# EAGLE design circuito (EAGLE 7.6.0)
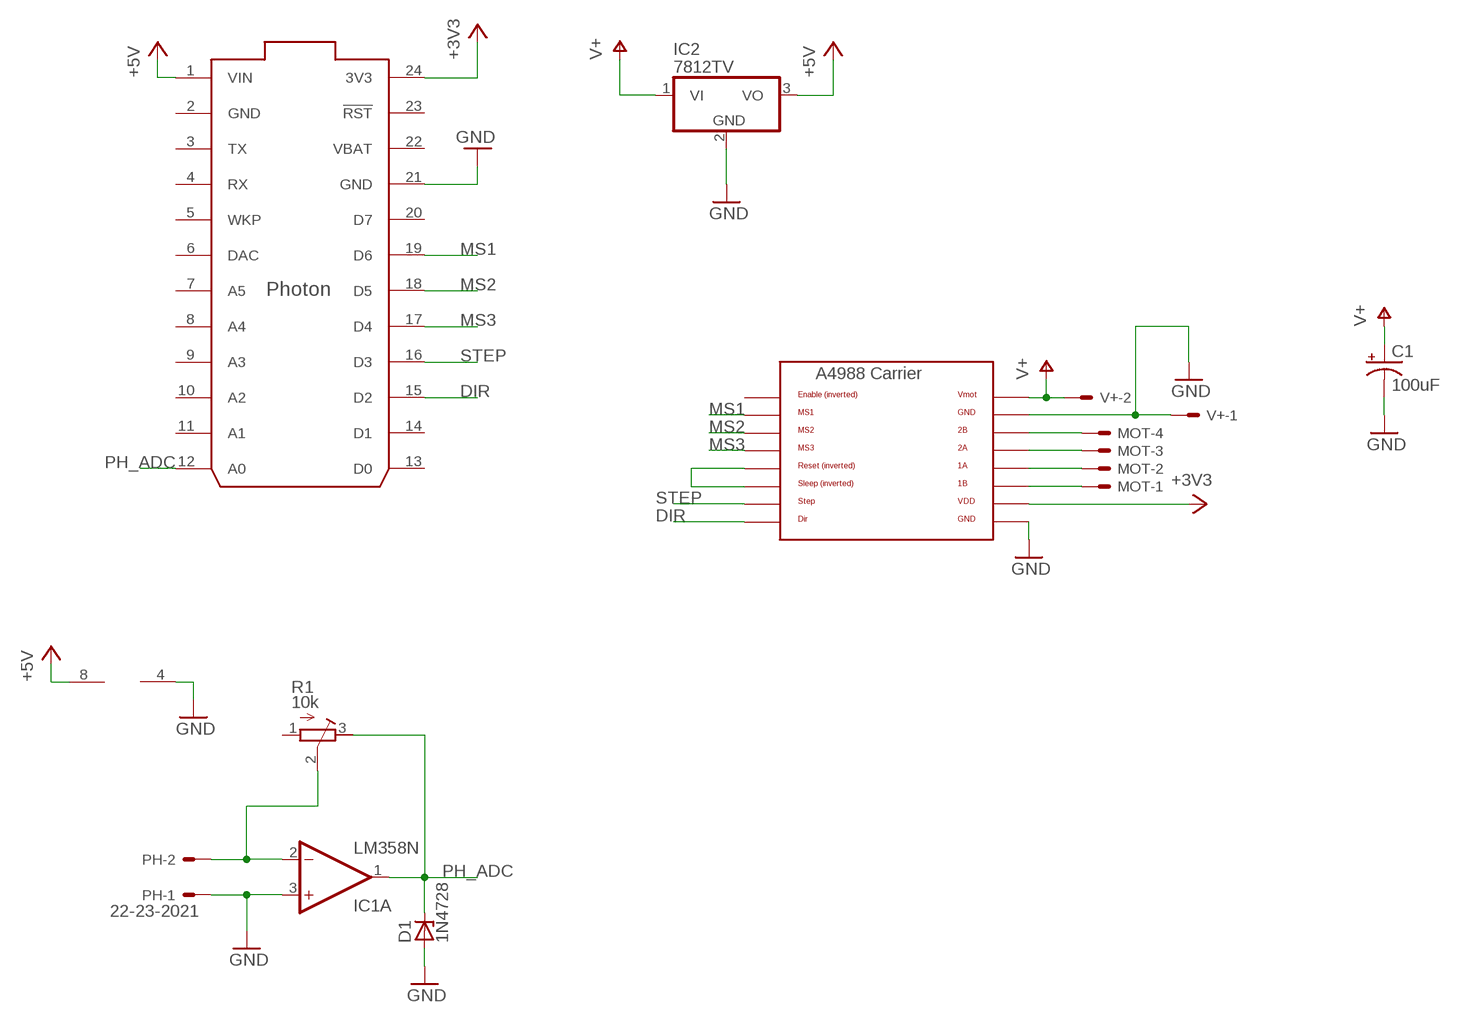
[diagram p0: schematic, sheet 1]

## Parts
C1  100uF  CPOL-USE3.5-8  [E3,5-8]
D1  1N4728  [DO41Z10]
IC1  LM358N  [DIL08]
IC2  7812TV  [TO220V]
MOT  22-23-2041  [22-23-2041]
PH  22-23-2021  [22-23-2021]
R1  10k  R-TRIMM64W  [RTRIM64W]
U$1  PHOTON_WITH_HEADERS  [PHOTON]
U$2  A4988BREAKOUT  [A4988BREAKOUT]
V+  22-23-2021  [22-23-2021]

## Nets
+3V3: U$1.24(3V3) U$2.VDD
+5V: IC1.8(P:V+) IC2.3(VO) U$1.1(VIN)
DIR: U$1.15(D2) U$2.DIR
GND: C1.- D1.A IC1.3(A:+IN) IC1.4(P:V-) IC2.2(GND) PH.1 U$1.21(GND) U$2.GND U$2.GND@0(GND) V+.1
MS1: U$1.19(D6) U$2.MS1
MS2: U$1.18(D5) U$2.MS2
MS3: U$1.17(D4) U$2.MS3
N$3: MOT.4 U$2.2B
N$4: U$2.RST U$2.SLP(SLEEP)
N$5: MOT.1 U$2.1B
N$6: MOT.2 U$2.1A
N$7: MOT.3 U$2.2A
N$13: IC1.2(A:-IN) PH.2 R1.2(S)
PH_ADC: D1.C IC1.1(A:OUT) R1.3(E) U$1.12(A0)
STEP: U$1.16(D3) U$2.STEP
V+: C1.+ IC2.1(VI) U$2.VMOT V+.2
Unconnected: IC1.5(B:+IN) IC1.6(B:-IN) IC1.7(B:OUT) R1.1(A) U$1.3(TX) U$1.4(RX) U$1.5(WKP) U$1.6(DAC) U$1.7(A5) U$1.8(A4) U$1.9(A3) U$1.10(A2) U$1.11(A1) U$1.13(D0) U$1.14(D1) U$1.20(D7) U$1.23(!RST) U$2.EN

## Power pins joined to a net without a drawn wire
GND: U$1.2(GND)
VBAT: U$1.22(VBAT)

## Library data of the parts
C1 = rcl:CPOL-US: POLARIZED CAPACITOR, American symbol
D1 = diode:1N4728: Z DIODE 3.3 V, 1W, 5 percent
IC1 = linear:LM358: OP AMP also LM158; LM258; LM2904 Source: http://cache.national.com/ds/LM/LM158.pdf
IC2 = linear:78*: Positive VOLTAGE REGULATOR Source: http://cache.national.com/ds/LM/LM78L05.pdf http://www.fairchildsemi.com/ds/LM/LM7805.pdf
MOT = con-molex:22-23-2041: .100" (2.54mm) Center Header - 4 Pin; MF: MOLEX; MPN: 22-23-2041; OC_FARNELL: 1462920; OC_NEWARK: 38C0355
PH V+ = con-molex:22-23-2021: .100" (2.54mm) Center Header - 2 Pin; MF: MOLEX; MPN: 22-23-2021; OC_FARNELL: 1462926; OC_NEWARK: 25C3832
R1 = rcl:R-TRIMM: Trimm resistor
U$1 = Spark:PHOTON
U$2 = RepRapjr:A4988BREAKOUT

## Board
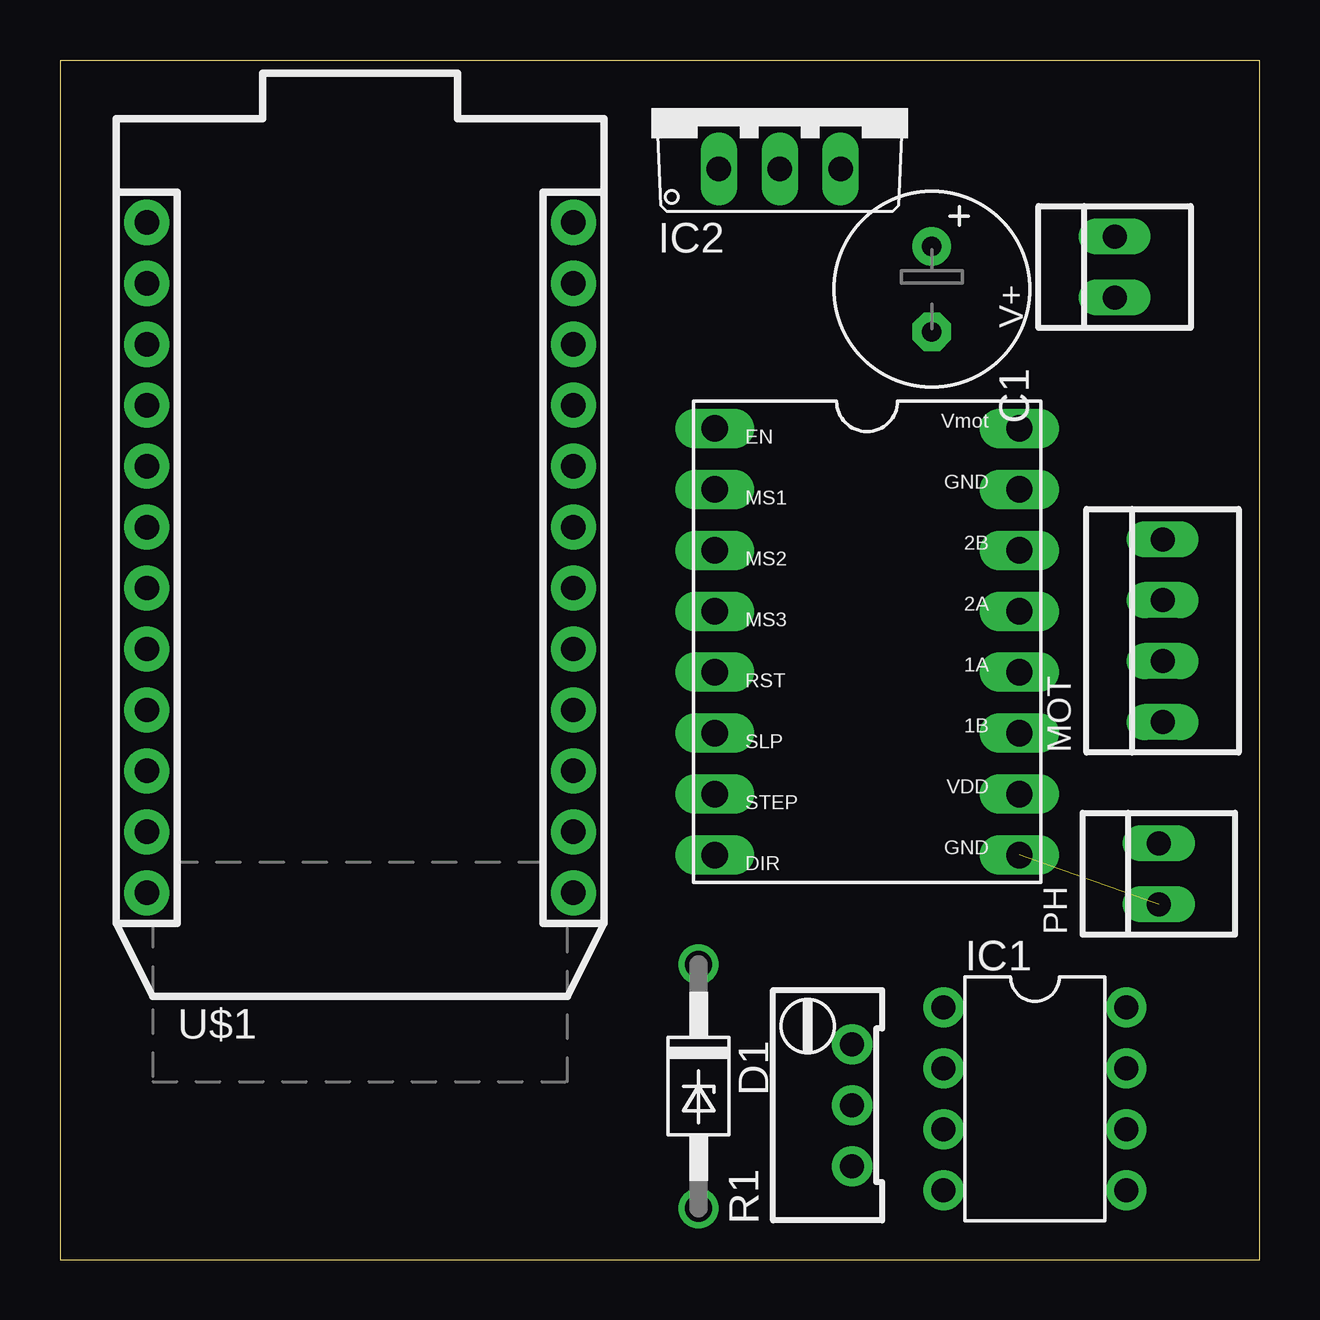
[diagram p1: board, top side]
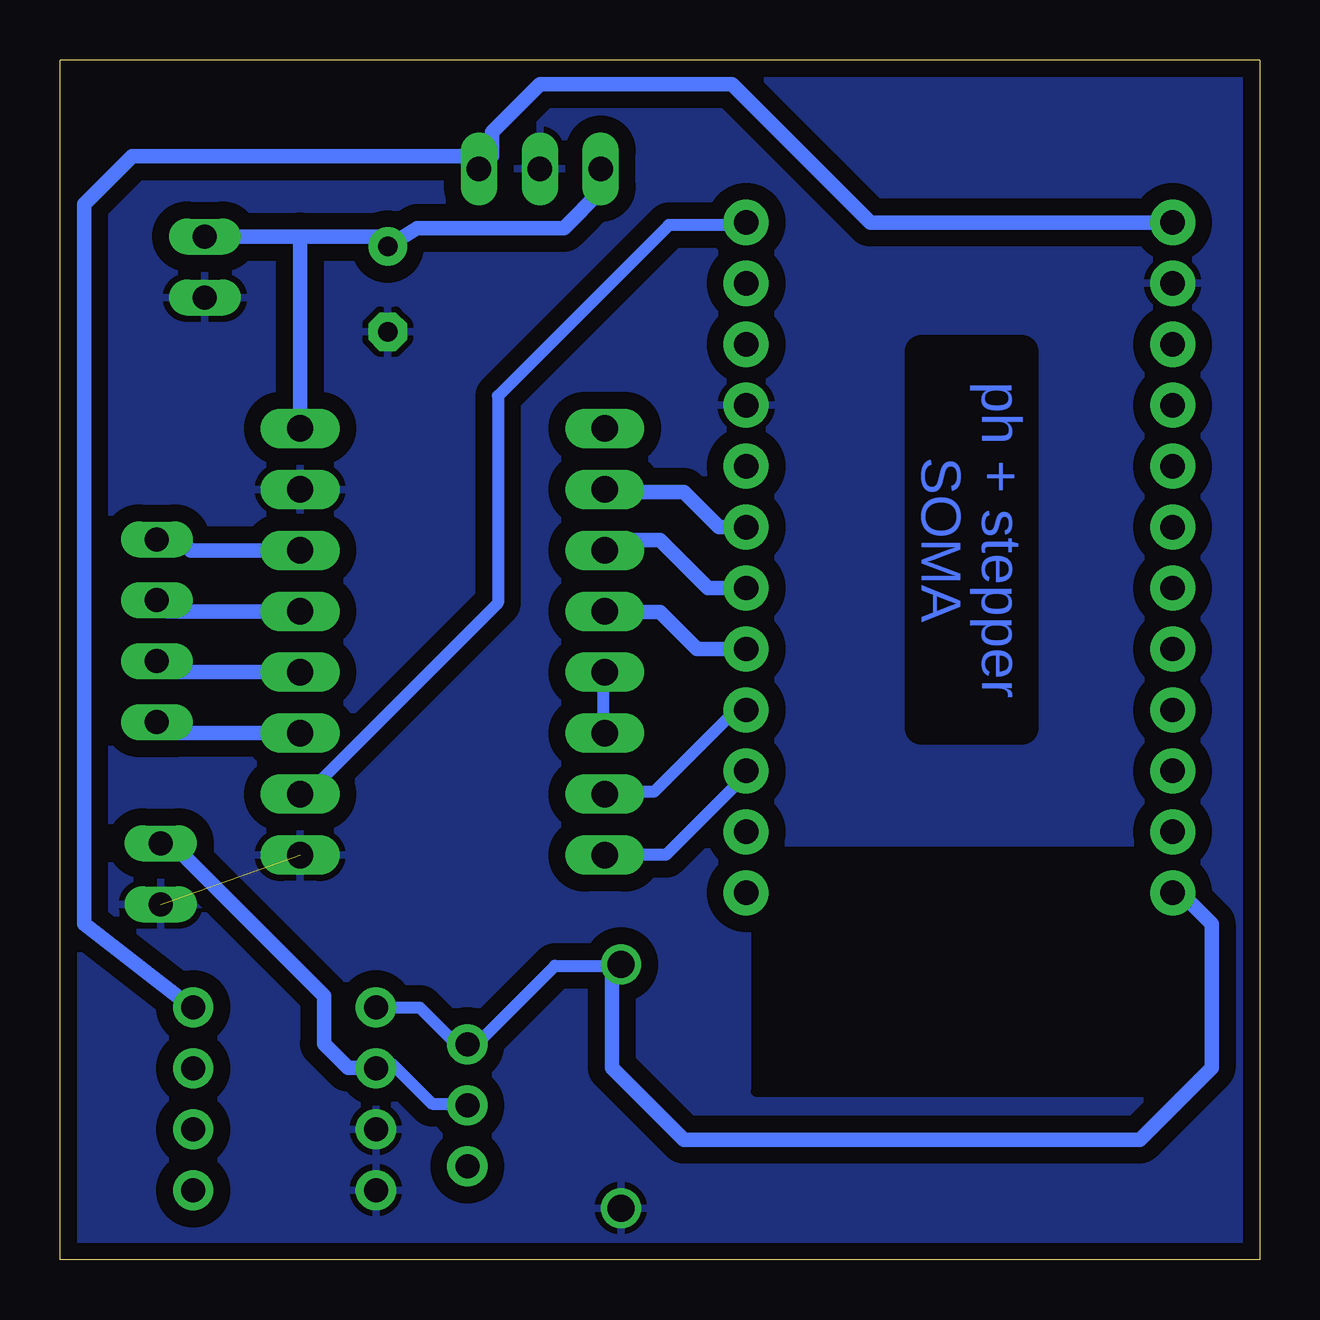
[diagram p2: board, bottom side, seen from below]

Size 50 x 50 mm. Coordinates in mm from the lower left corner, seen from the top.
Outline: 0,0 50,0 50,50 0,50 0,0
Copper layers (1*16): Top 0.035mm / dielectric 1.5mm / Bottom 0.035mm
Design rules "default *": minimum track width 0.5mm, minimum drill 0.8mm, track to track 8mil, track to pad 8mil, pad to pad 8mil, via to via 8mil, smd to smd 8mil, copper to edge 20mil, drill to drill 8mil, minimum pad ring 10mil, minimum via ring 8mil, stop-mask expansion 4mil, vias tented up to drill 0mil, thermal gap 10mil

### Footprints (pad centres in the part's own frame; a part is rotated, then mirrored left to right if it is on the bottom)
E3,5-8 = drill 0.813 pad 1.6: + -1.778,0 | drill 0.813 pad 1.6 octagon: - 1.778,0
DO41Z10 = drill 1.118: A 5.08,0; C -5.08,0
DIL08 = drill 1 pad 1.676: 1 -3.81,-3.81; 2 -1.27,-3.81; 3 1.27,-3.81; 4 3.81,-3.81; 5 3.81,3.81; 6 1.27,3.81; 7 -1.27,3.81; 8 -3.81,3.81
TO220V = drill 1.016 long: 1 -2.54,-2.54; 2 0,-2.54; 3 2.54,-2.54
22-23-2041 = drill 1 long: 1 -3.81,0; 2 -1.27,0; 3 1.27,0; 4 3.81,0
22-23-2021 = drill 1 long: 1 -1.27,0; 2 1.27,0
RTRIM64W = drill 1 pad 1.676: 1 1.27,-2.54; 2 1.27,0; 3 1.27,2.54
PHOTON = drill 1.016 pad 1.88: 1 1.27,32.258; 2 1.27,29.718; 3 1.27,27.178; 4 1.27,24.638; 5 1.27,22.098; 6 1.27,19.558; 7 1.27,17.018; 8 1.27,14.478; 9 1.27,11.938; 10 1.27,9.398; 11 1.27,6.858; 12 1.27,4.318; 13 19.05,4.318; 14 19.05,6.858; 15 19.05,9.398; 16 19.05,11.938; 17 19.05,14.478; 18 19.05,17.018; 19 19.05,19.558; 20 19.05,22.098; 21 19.05,24.638; 22 19.05,27.178; 23 19.05,29.718; 24 19.05,32.258
A4988BREAKOUT = drill 1.1 long: 1A 8.89,1.27; 1B 11.43,1.27; 2A 6.35,1.27; 2B 3.81,1.27; DIR 16.51,-11.43; EN -1.27,-11.43; GND 16.51,1.27; GND@0 1.27,1.27; MS1 1.27,-11.43; MS2 3.81,-11.43; MS3 6.35,-11.43; RST 8.89,-11.43; SLP 11.43,-11.43; STEP 13.97,-11.43; VDD 13.97,1.27; VMOT -1.27,1.27

### Placement (x,y rotation side)
C1  36.34,40.45 270 top
D1  26.62,7.22 270 top
IC1  40.64,6.7 270 top
IC2  30,48 0 top
MOT  45.96,26.21 90 top
PH  45.8,16.08 90 top
R1  31.75,6.43 0 top
U$1  2.35,10.97 0 top
U$2  38.72,33.37 270 top
V+  43.96,41.37 90 top

### Tracks (layer width: path | path; a pad name or v marks a point on that pad's centre or on a via)
+3V3
  Bottom 0.5: U$2.VDD 39.88,19.5 39.62,19.5 31.75,27.38 31.75,36 24.62,43.12 21.5,43.12 U$1.24
+5V
  Bottom 0.61: U$1.1 16.23,43.23 22,49 30,49 32,47 32,46 IC2.3 33.08,46 47,46 49,44 49,14 44.51,10.51 IC1.8
DIR
  Bottom 0.5: U$2.DIR 27.25,16.88 24.75,16.88 21.38,20.25 U$1.15
GND  (1 unrouted)
  pour Bottom (isolate 0.7): 0,0 0,50 50,50 50,0
MS1
  Bottom 0.61: U$1.19 22.53,30.53 24,32 27.19,32 U$2.MS1
MS2
  Bottom 0.61: U$1.18 22.99,27.99 25,30 26.85,30 U$2.MS2
MS3
  Bottom 0.61: U$1.17 23.45,25.45 25,27 27.27,27 U$2.MS3
N$2
  cutout Bottom: 5,17 20,17 20,14 21,14 21,7 4,7 4,14 5,14
N$3
  Bottom 0.61: U$2.2B 44.56,29.56 45,30 45.94,30 MOT.4
N$4
  Bottom 0.5: U$2.SLP 27.38,22 27.38,24.38 U$2.RST
N$5
  Bottom 0.61: U$2.1B 45.5,21.94 MOT.1
N$6
  Bottom 0.61: U$2.1A 45.5,24.48 MOT.2
N$7
  Bottom 0.61: U$2.2A 45.5,27.02 MOT.3
N$13
  Bottom 0.5: R1.2 33.12,6.5 34.5,6.5 36.12,8.12 36.62,8.12 IC1.2
  Bottom 0.61: PH.2 45.35,17.35 39,11 39,9 38,8 36.86,8 IC1.2
PH_ADC
  Bottom 0.5: D1.C 26.62,12.25 29.38,12.25 32.62,9 33,9 R1.3 33.25,9 33.5,9 35,10.5 36.75,10.5 IC1.1
  Bottom 0.61: U$1.12 3.29,15.29 2,14 2,8 5,5 24,5 27,8 27,11.92 D1.C
STEP
  Bottom 0.5: U$2.STEP 27.25,19.5 25.25,19.5 21.88,22.88 21.5,22.88 U$1.16
V+
  Bottom 0.61: IC2.1 27.46,44.54 29,43 35.11,43 C1.+ 36.75,42.64 40,42.64 | V+.2 40,42.64 | U$2.VMOT 39.99,42.63 40,42.64

### Text on the board
Bottom: ph + stepper / SOMA